# Altium schematic sheet boost.SchDoc
size A4
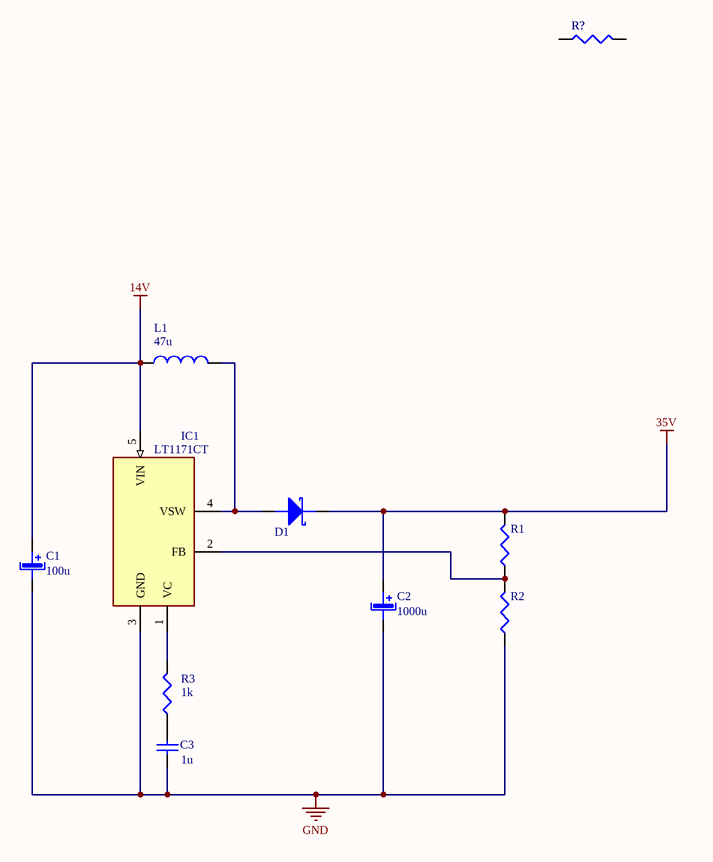
[diagram p0: boost.SchDoc]

## Parts
(Parts that share a designator on the sheet are numbered #1, #2 ... from top to bottom, then left to right.)
C1  100u
C2  1000u
C3  1u
D1  Diode Schottky  (value not drawn)
IC1  LT1171CT  [TO170P457X1022X2306-5P]
L1  47u
R1  Résistance  (value not drawn)
R2  Résistance  (value not drawn)
R3  1k
R?#1  Résistance  (value not drawn)
R?#2  Résistance  (value not drawn)

## Nets
14V: C1.1(+) IC1.5(VIN) L1.1
35V: C2.1(+) D1.2(K) R1.2
GND: C1.2(-) C2.2(-) C3.2 IC1.3(GND) R2.1
NetC3_1: C3.1 R3.1
NetD1_1: D1.1(A) IC1.4(VSW) L1.2
NetIC1_1: IC1.1(VC) R3.2
NetIC1_2: IC1.2(FB) R1.1 R2.2
NetR?#1_1: R?#1.1 R?#2.1
NetR?#1_2: R?#1.2 R?#2.2

## Library data of the parts
C1 C2 = Cond pol radial: Condensateur polatisé; Type: Condensateur polarisé debout; Designer: ECAM 2004
C3 = Condensateur: Supplier: Farnell; Designer: ECAM 2004
IC1 = LT1171CT#PBF: Integrated Circuit; Manufacturer_Name: Linear Technology; Datasheet Link: http://docs-emea.rs-online.com/webdocs/13ec/0900766b813ec9fd.pdf; Height: 4.572mm; Manufacturer_Part_Number: LT1171CT#PBF; Mouser Part Number: 584-LT1171CT#PBF; Mouser Price/Stock: https://www.mouser.com/Search/Refine.aspx?Keyword=584-LT1171CT%23PBF; RS Part Number: 5455001; RS Price/Stock: https://uk.rs-online.com/web/p/products/5455001
L1 = Inductance: Designer: ECAM 2003
R1-R3 R?#1 R?#2 = Résistance: Résistance standard; Designer: ECAM 2005; Type: Résistance standard
D1 = Diode Schottky: Designer: ECAM 2005